# Altium schematic sheet DiscoCarrier.SchDoc
size A4; SheetNumber: 3; SheetTotal: 6
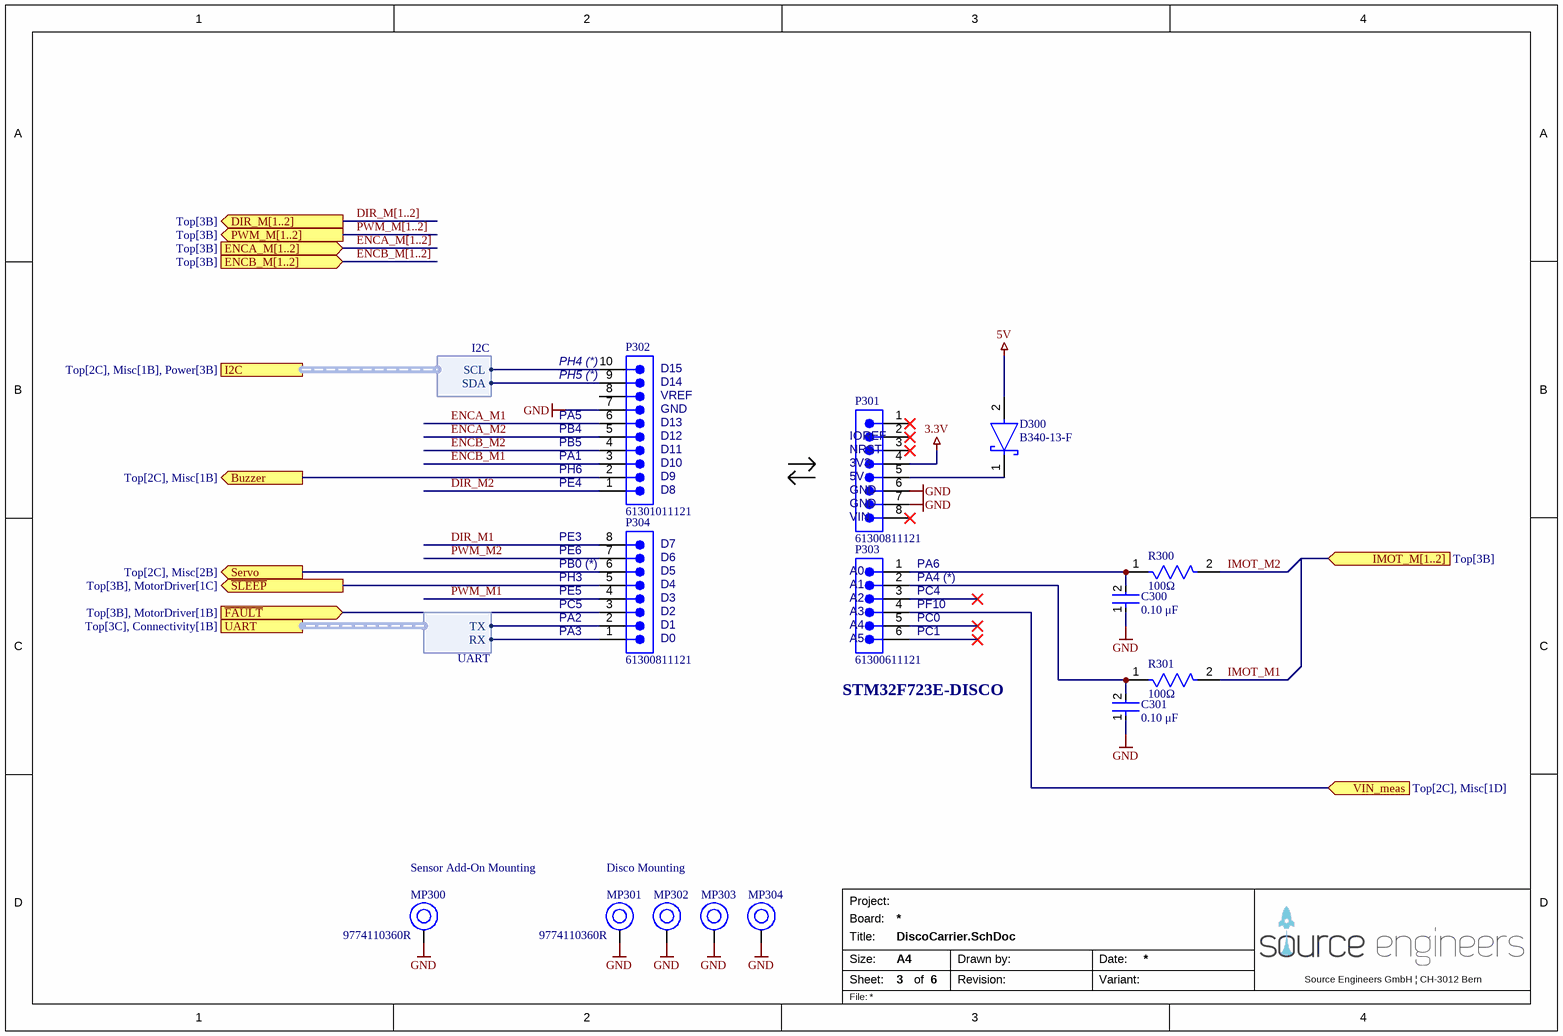
[diagram p0: DiscoCarrier.SchDoc]

## Parts
C300  value 0.10 μF  [FP-C0603C-CF-MFG]  (hidden comment: C0603C104M5RACTU)
C301  value 0.10 μF  [FP-C0603C-CF-MFG]  (hidden comment: C0603C104M5RACTU)
D300  B340-13-F  [FP-SMC-MFG]
MP300  9774110360R  [9774110360]
MP301  9774110360R  [9774110360]
MP302  9774110360R  [9774110360]  (value not drawn)
MP303  9774110360R  [9774110360]  (value not drawn)
MP304  9774110360R  [9774110360]  (value not drawn)
P301  61300811121  [61300811121]
P302  61301011121  [61301011121]
P303  61300611121  [61300611121]
P304  61300811121  [61300811121]
R300  Resistance: 100Ω  [FP-RT0603-MFG]  (hidden comment: RT0603FRE07100RL)
R301  Resistance: 100Ω  [FP-RT0603-MFG]  (hidden comment: RT0603FRE07100RL)

## Ports
Buzzer (out, see Top[2C], Misc[1B]), DIR_M[1..2] (out, see Top[3B]), ENCA_M[1..2] (in, see Top[3B]), ENCB_M[1..2] (in, see Top[3B]), I2C (harness I2C, see Top[2C], Misc[1B], Power[3B]), IMOT_M[1..2] (in, see Top[3B]), PWM_M[1..2] (out, see Top[3B]), Servo (out, see Top[2C], Misc[2B]), UART (harness UART, see Top[3C], Connectivity[1B]), VIN_meas (in, see Top[2C], Misc[1D]), ~{FAULT} (in, see Top[3B], MotorDriver[1B]), ~{SLEEP} (out, see Top[3B], MotorDriver[1C])

## Harnesses
UART: TX, RX
I2C: SCL, SDA

## Nets
3.3V: P301.4
5V: D300.2(A)
GND: C300.1 C301.1 MP300.1 MP301.1 MP302.1 MP303.1 MP304.1 P301.6 P301.7 P302.7
Buzzer: P302.2 ; port Buzzer
DIR_M1: P304.8
DIR_M2: P302.1
ENCA_M1: P302.6
ENCA_M2: P302.5
ENCB_M1: P302.3
ENCB_M2: P302.4
~{FAULT}: P304.3 ; port ~{FAULT}
IMOT_M1: R301.2
IMOT_M2: R300.2
PWM_M1: P304.4
PWM_M2: P304.7
~{SLEEP}: P304.5 ; port ~{SLEEP}
Servo: P304.6 ; port Servo
VIN_meas: P303.4 ; port VIN_meas
NetC300_2: C300.2 P303.1 R300.1
NetC301_2: C301.2 P303.2 R301.1
NetD300_1: D300.1(C) P301.5
NetP302_9: P302.9 ; port I2C.SDA
NetP302_10: P302.10 ; port I2C.SCL
NetP304_1: P304.1 ; port UART.RX
NetP304_2: P304.2 ; port UART.TX

Not connected (* = marked no-connect by the designer): P301 1* 2* 3* 8*; P302 8; P303 3* 5* 6*

## Buses and harness runs
bus DIR_M[1..2] = port DIR_M[1..2]
bus ENCA_M[1..2] = port ENCA_M[1..2]
bus ENCB_M[1..2] = port ENCB_M[1..2]
bus PWM_M[1..2] = port PWM_M[1..2]

## Notes on the sheet
- (near P302) PH4 (*)
- (near P302) PH5 (*)
- (near P302) D14
- (near P302) D15
- (near P302) PB5
- (near P302) PB4
- (near P302) PA5
- (near P302) VREF
- (near P302) GND
- (near P302) D12
- (near P302) D13
- (near P301) IOREF
- (near P302) PA1
- PE4
- (near P302) PH6
- (near P302) D8
- (near P302) D9
- (near P302) D10
- (near P302) D11
- (near P301) NRST
- (near P301) 3V3
- (near P301) 5V
- (near P301) GND
- (near P301) VIN
- (near P304) PH3
- PE6
- PE3
- (near P304) PB0 (*)
- (near P304) D5
- (near P304) D6
- (near P304) D7
- (near P303) A0
- PA6
- (near P303) PA4 (*)
- (near P304) PA2
- (near P304) PC5
- (near P304) PE5
- (near P304) PA3
- (near P304) D0
- (near P304) D1
- (near P304) D2
- (near P304) D3
- (near P304) D4
- (near P303) A1
- (near P303) A2
- (near P303) A3
- (near P303) A4
- (near P303) A5
- (near P303) PC4
- (near P303) PF10
- (near P303) PC0
- (near P303) PC1
- STM32F723E-DISCO
- Sensor Add-On Mounting
- Disco Mounting
- Project:
- Board:
- Title:
- Size:
- Sheet:
- of
- Drawn by:
- Revision:
- Date:
- Variant:
- Source Engineers GmbH | CH-3012 Bern
- File:

## Library data of the parts
C300 C301 = CMP-2006-03068-2: CAP CER 0.1UF 50V 20% X7R 0603; Manufacturer: KEMET; Material: Ceramic; Tolerance: 0.2; Temperature Coefficient: 30ppm/°C; Automotive Grade: Grade 1; Temperature Range High: +125°C; Voltage Rating: 50 V; Device Class L3: Ceramic Capacitors; Manufacturer Part Number: C0603C104M5RACTU; Height: 0.87mm; Category: Cap; RoHS: TRUE; Digikey Description: CAP CER 0.1UF 50V 20% X7R 0603; ComponentLink2URL: https://api.kemet.com/component-edge/download/datasheet/C0603C100J5GACAUTO.pdf; Lead Free: Yes; Temperature Range Low: -55°C; Device Class L1: Passive Components; ComponentLink2Description: Datasheet; Temperature Characteristic: X7R; Automotive: Yes; Temperature: -55°C to +125°C; Octopart: https://octopart.com/c0603c104m5ractu-kemet-11855687; Device Class L2: Capacitors; Package: C0603C-CF; Mouser Description: Multilayer Ceramic Capacitors MLCC - SMD/SMT 50volts 0.1uF X7R 20%; Capacitance: 0.10 μF
D300 = CMP-12790-000049-1: DIODE SCHOTTKY 40V 3A SMC; Manufacturer: Diodes Inc.; Max Surge Forward Current: 100A; Peak Reverse Current: 0.1mA; Max Junction Temp: +150°C; Value: 200pF; Standoff Height: 0.1mm; Temperature: -55°C to +150°C; Reverse Voltage: 40V; Max Repetitive Reverse Voltage: 40V; Forward Current: 3A; Device Class L2: Diodes; RoHS: TRUE; Footprint Url: https://www.diodes.com/assets/Package-Files/SMC.pdf; Digikey Description: DIODE SCHOTTKY 40V 3A SMC; Package: SMC; Category: Diode; ComponentLink2Description: Datasheet; Temperature Range High: +150°C; Lead Free: Yes; Mouser Description: Diode Schottky 40V 3A 2-Pin SMC T/R Diode Schottky 40V 3A 2-Pin SMC T/R; Manufacturer Part Number: B340-13-F; Octopart: https://octopart.com/b340-13-f-diodes+inc.-325814; Automotive: No; ComponentLink2URL: https://www.diodes.com/assets/Datasheets/ds30923.pdf; Capacitance: 200pF; Device Class L1: Discrete Semiconductors; Temperature Range Low: -55°C; Height: 2.5mm; Device Class L3: Schottky Diodes
MP300-MP304 = CMP-03913-39399854-1: 9774110360R Spacer Material: Steel, Tin-Plated Mounting: SMT Series: WA-SMSI Thread D: M3; Plating: Tin; Threaded/Unthreaded: Threaded; Outside Diameter: 5.9944mm; Length: 11mm; Min Operating Temperature: -55°C; NexarPartId: 39399854; Packaging: Tape and Reel; Material: Steel; Thread Size: M3; Width: 6mm; REACH SVHC: Unknown; Max Operating Temperature: 150°C; Height: 11.1mm; Lead Free: Lead Free; RoHS: Compliant; Case/Package: SMD/SMT; Mount: External
P301 P304 = CMP-1502-01076-3: NexarPartId: 32855533; Connector Type: Male Pin; Number of Contacts: 8; Voltage Rating: 250V; Current Rating: 3A; Contact Resistance: 20mΩ; Pitch: 2.54mm; Gender: Male; Termination: Solder; Contact Material: Copper; Mount: Through Hole; Lead Pitch: 2.54mm; Number of Positions: 8; Operating Supply Voltage: 250V; Number of Pins: 8; Max Operating Temperature: 105°C; Height: 8.54mm; REACH SVHC: Unknown; Number of Rows: 1; Packaging: Bulk; Contact Plating: Gold; Contact Mating Length: 5.9944mm; Orientation: Vertical; RoHS: Compliant; Color: Black; Min Operating Temperature: -40°C
P302 = CMP-1502-01082-5: NexarPartId: 18818159; Gender: Male; Number of Positions: 10; Operating Supply Voltage: 250V; Current Rating: 3A; Contact Resistance: 20mΩ; Connector Type: Male Pin; Insulation Resistance: 1GΩ; Pitch: 2.54mm; Color: Black; Contact Gender: Male; Height: 8.74mm; Orientation: Vertical; RoHS: Compliant; Packaging: Bulk; Min Operating Temperature: -40°C; Number of Pins: 10; Max Operating Temperature: 105°C; REACH SVHC: Unknown; Voltage Rating: 250V; Number of Rows: 1; Housing Material: PBT; Number of Contacts: 10; Mount: Through Hole; Contact Mating Length: 5.9944mm; Length: 2.54mm; Lead Pitch: 2.54mm; Flammability Rating: UL94 V-0; Termination: Solder; Contact Material: Copper; Width: 25.4mm; Contact Plating: Gold
P303 = CMP-1502-01070-3: NexarPartId: 20084590; Current Rating: 3A; Pitch: 2.54mm; Gender: Male; Operating Supply Voltage: 250V; Connector Type: Male Pin; Number of Positions: 6; Contact Resistance: 20mΩ; Packaging: Bulk; Number of Pins: 6; Number of Rows: 1; Contact Plating: Gold; Lead Free: Lead Free; RoHS: Compliant; Contact Mating Length: 5.9944mm; Voltage Rating: 250V; REACH SVHC: Unknown; Contact Gender: Male; Housing Material: PBT; Min Operating Temperature: -40°C; Lead Pitch: 2.54mm; Mount: Through Hole; Number of Contacts: 6; Max Operating Temperature: 105°C; Contact Material: Copper; Orientation: Vertical; Termination: Through Hole; Color: Black; Height: 8.89mm
R300 R301 = CMP-03412-022806-1: RES SMD 100 OHM 1% 1/10W 0603; Manufacturer: Yageo; Value: 100Ω; Power Rating: 0.1W; Voltage Rating: 75V; Temperature Coefficient: 50 ppm/°C; Tolerance: 0.01; Manufacturer Part Number: RT0603FRE07100RL; Mouser Description: Thin Film Resistors - SMD 1/10W 100 ohm 1% 50ppm; Ipc Land Pattern Name: RESC16080X45; Height: 0.55mm; Category: Res; Temperature Range Low: -55°C; Lead Free: Yes; Automotive: No; Device Class L3: Chip SMD Resistors; ComponentLink2Description: Datasheet; Device Class L2: Resistors; RoHS: TRUE; Footprint Url: http://www.yageo.com/exep/pages/download/literatures/PYu-R_Mount_10.pdf; Digikey Description: RES SMD 100 OHM 1% 1/10W 0603; Temperature Range High: +155°C; Package: RT0603; Device Class L1: Passive Components; Series: RT; Temperature: -55°C to +155°C; Octopart: https://octopart.com/rt0603fre07100rl-yageo-39792638; Composition: Thin Film; ComponentLink2URL: http://www.yageo.com/documents/recent/PYu-RT_1-to-0.01_RoHS_L_9.pdf